# EAGLE schematic touche_client (EAGLE 9.6.2)
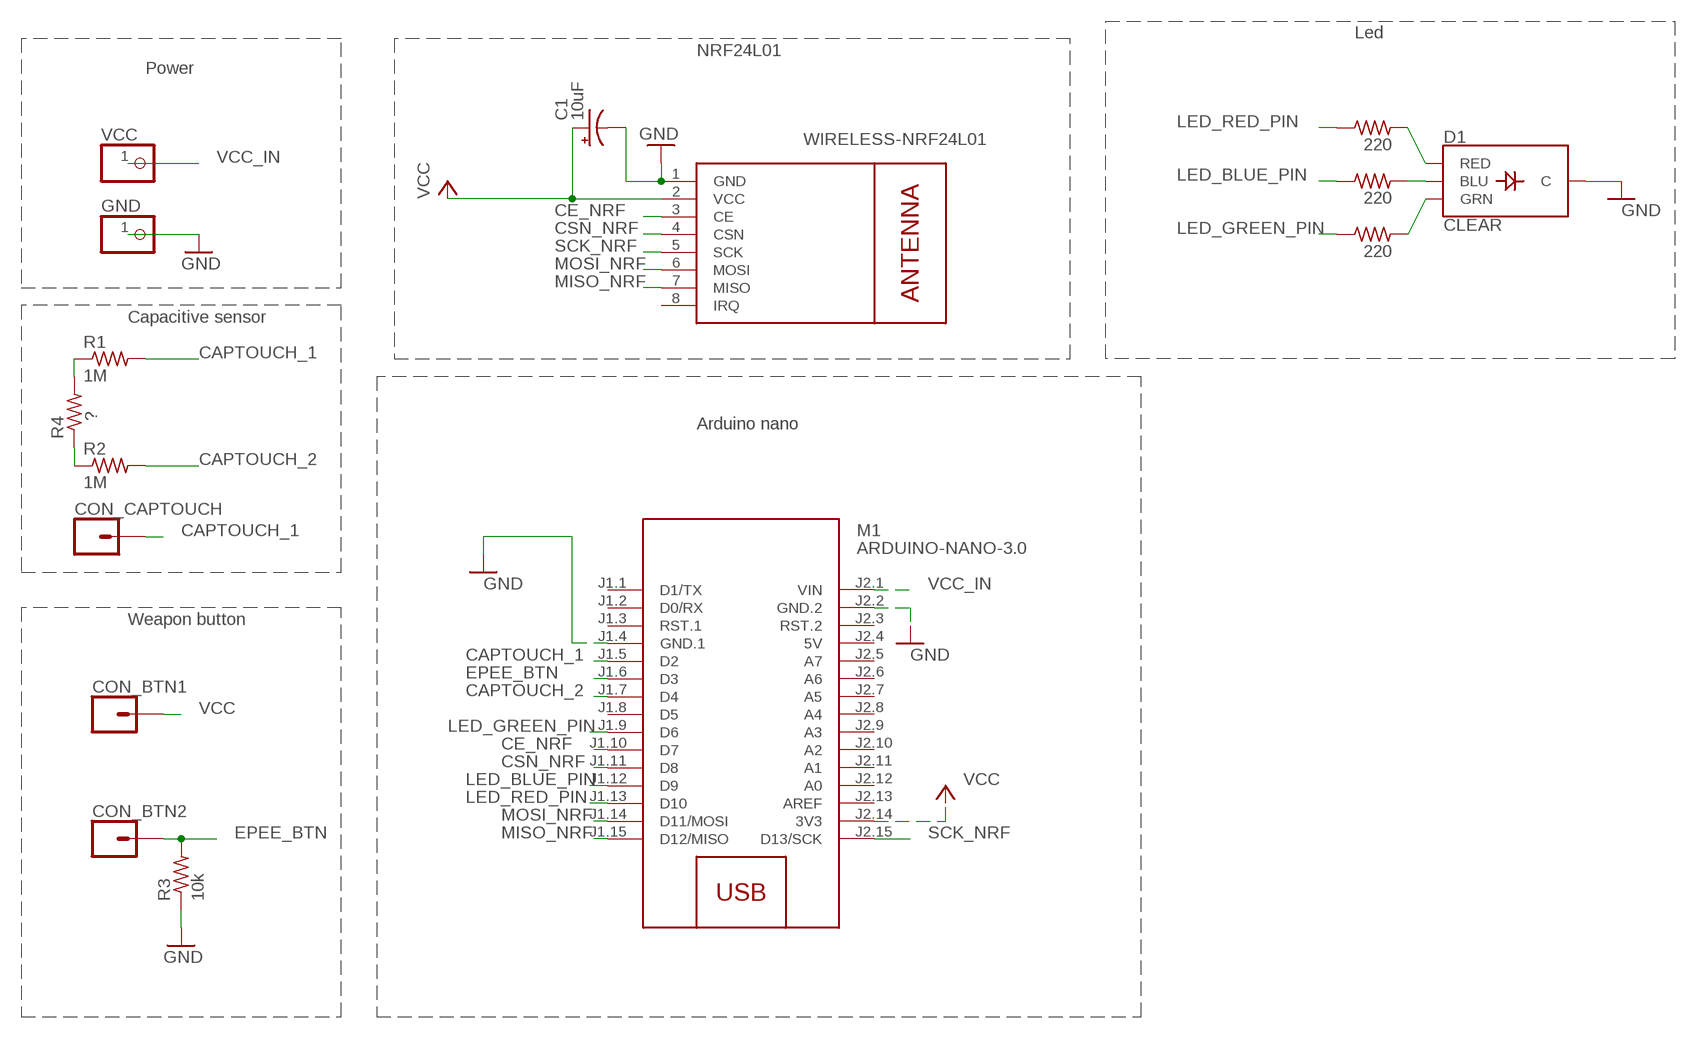
[diagram p0: schematic, sheet 1]

## Parts
C1  10uF  CPOL-USE2-5  [E2-5]
CON_BTN1  CONN_01  [1X01]
CON_BTN2  CONN_01  [1X01]
CON_CAPTOUCH  CONN_01  [1X01]
D1  CLEAR  LED-RGB-CCCLEAR  [LED-RGB-THRU]
GND  PINHD-1X1  [1X01]
M1  ARDUINO-NANO-3.0  [ARDUINO-NANO-3.0]
M2  WIRELESS-NRF24L01  [WIRELESS-NRF24L01]
R1  1M  R-US_0204/7  [0204/7]
R2  1M  R-US_0204/7  [0204/7]
R3  10k  R-US_0204/7  [0204/7]
R4  ?  R-US_0204/7  [0204/7]
R_LED1  220  R-US_0204/7  [0204/7]
R_LED2  220  R-US_0204/7  [0204/7]
R_LED3  220  R-US_0204/7  [0204/7]
VCC  PINHD-1X1  [1X01]

## Nets
CAPTOUCH_1: CON_CAPTOUCH.1 M1.J1.5(D2) R1.2
CAPTOUCH_2: M1.J1.7(D4) R2.2
CE_NRF: M1.J1.10(D7) M2.3(CE)
CSN_NRF: M1.J1.11(D8) M2.4(CSN)
EPEE_BTN: CON_BTN2.1 M1.J1.6(D3) R3.2
GND: C1.- D1.2(C) GND.1 M1.J1.4(GND.1) M1.J2.2(GND.2) M2.1(GND) R3.1
LED_BLUE_PIN: M1.J1.12(D9) R_LED2.1
LED_GREEN_PIN: M1.J1.9(D6) R_LED3.1
LED_RED_PIN: M1.J1.13(D10) R_LED1.1
MISO_NRF: M1.J1.15(D12/MISO) M2.7(MISO)
MOSI_NRF: M1.J1.14(D11/MOSI) M2.6(MOSI)
N$1: R1.1 R4.2
N$2: D1.1(RED) R_LED1.2
N$3: R2.1 R4.1
N$4: D1.4(BLU) R_LED2.2
N$5: D1.3(GRN) R_LED3.2
SCK_NRF: M1.J2.15(D13/SCK) M2.5(SCK)
VCC: C1.+ CON_BTN1.1 M1.J2.14(3V3) M2.2(VCC)
VCC_IN: M1.J2.1(VIN) VCC.1
Unconnected: M1.J1.1(D1/TX) M1.J1.2(D0/RX) M1.J1.3(RST.1) M1.J1.8(D5) M1.J2.3(RST.2) M1.J2.5(A7) M1.J2.6(A6) M1.J2.7(A5) M1.J2.8(A4) M1.J2.9(A3) M1.J2.10(A2) M1.J2.11(A1) M1.J2.12(A0) M1.J2.13(AREF) M2.8(IRQ)

## Notes on the sheet
- Led
- NRF24L01
- Power
- Capacitive sensor
- Arduino nano
- Weapon button

## Power pins joined to a net without a drawn wire
5V: M1.J2.4(5V)

## Library data of the parts
C1 = rcl:CPOL-US: POLARIZED CAPACITOR, American symbol; SPICEPREFIX: C
CON_BTN1 CON_BTN2 CON_CAPTOUCH = SparkFun-Connectors:CONN_01: Single connection point. Often used as Generic Header-pin footprint for 0.1 inch spaced/style header connections On any of the 0.1 inch spaced packages, you can populate with these: Break Away Headers - Straight <https://www.sparkfun.com/products/116> (PRT-00116) Break Away Male Headers - Right Angle <https://www.sparkfun.com/products/553> (PRT-00553) Female Headers <https://www.sparkfun.com/products/115> (PRT-00115) Break Away Headers - Machine Pin <https://www.sparkfun.com/products/117> (PRT-00117) Break Away Female Headers - Swiss Machine Pin <https://www.sparkfun.com/products/743> (PRT-00743) This device is also useful as a general connection point to wire up your design to another part of your project. Our various solder wires solder well into these plated through hole pads. Hook-Up Wire - Assortment (Stranded, 22 AWG) <https://www.sparkfun.com/products/11375> (PRT-11375) Hook-Up Wire - Assortment (Solid Core, 22 AWG) <https://www.sparkfun.com/products/11367> (PRT-11367) View the entire wire category on our website here <https://www.sparkfun.com/categories/141> Special notes: SMTSO-256-ET is a "flush mount" nut for a 4-40 screw. We mostly use this on specialty testbeds; it is a nice way to connect hardware to your PCB at an adjustable hieght. Also note, the SNAP packages are for using a snappable style connector. We sell a baggie of snaps and they are also used on two LilyPad designs: Snap Assortment - 30 pack (male and female) <https://www.sparkfun.com/products/11347> (DEV-11347) LilyPad Arduino SimpleSnap <https://www.sparkfun.com/products/10941> (DEV-10941) LilyPad SimpleSnap Protoboard <https://www.sparkfun.com/products/10940> (DEV-10940)
D1 = SparkFun-LED:LED-RGB-CC: LED-RGB Common Cathode Packages: LED RGB-THRU LED_PIRANHA_5MM SparkFun Products: RGB Diffused Common Cathode- Diffuse <[https://www.sparkfun.com/products/9264]> RGB Diffused Common Cathode - Clear <[https://www.sparkfun.com/products/105]> LED-RGB 5mm Square (Piranha) <[https://www.sparkfun.com/products/11679]>; PROD_ID: DIO-08418
GND VCC = pinhead:PINHD-1X1: PIN HEADER
M1 = wsff_lib:ARDUINO-NANO-3.0: Arduino Nano 3.0 and compatible devices More details available here: https://www.arduino.cc/en/Main/ArduinoBoardNano Click here to find device on ebay.com <http://www.ebay.com/sch/arduino+nano>
M2 = wsff_lib:WIRELESS-NRF24L01: 2.4 GHz Wireless Module based on NRF24L01 chip More details available here: http://www.electrodragon.com/w/NRF24L01 Click here to find device on ebay.com <http://www.ebay.com/sch/nrf24l01+arduino>
R1-R4 R_LED1-R_LED3 = rcl:R-US_: RESISTOR, American symbol; SPICEPREFIX: R